# EAGLE design Protoboard MX4-7-6 (EAGLE 7.7.0)
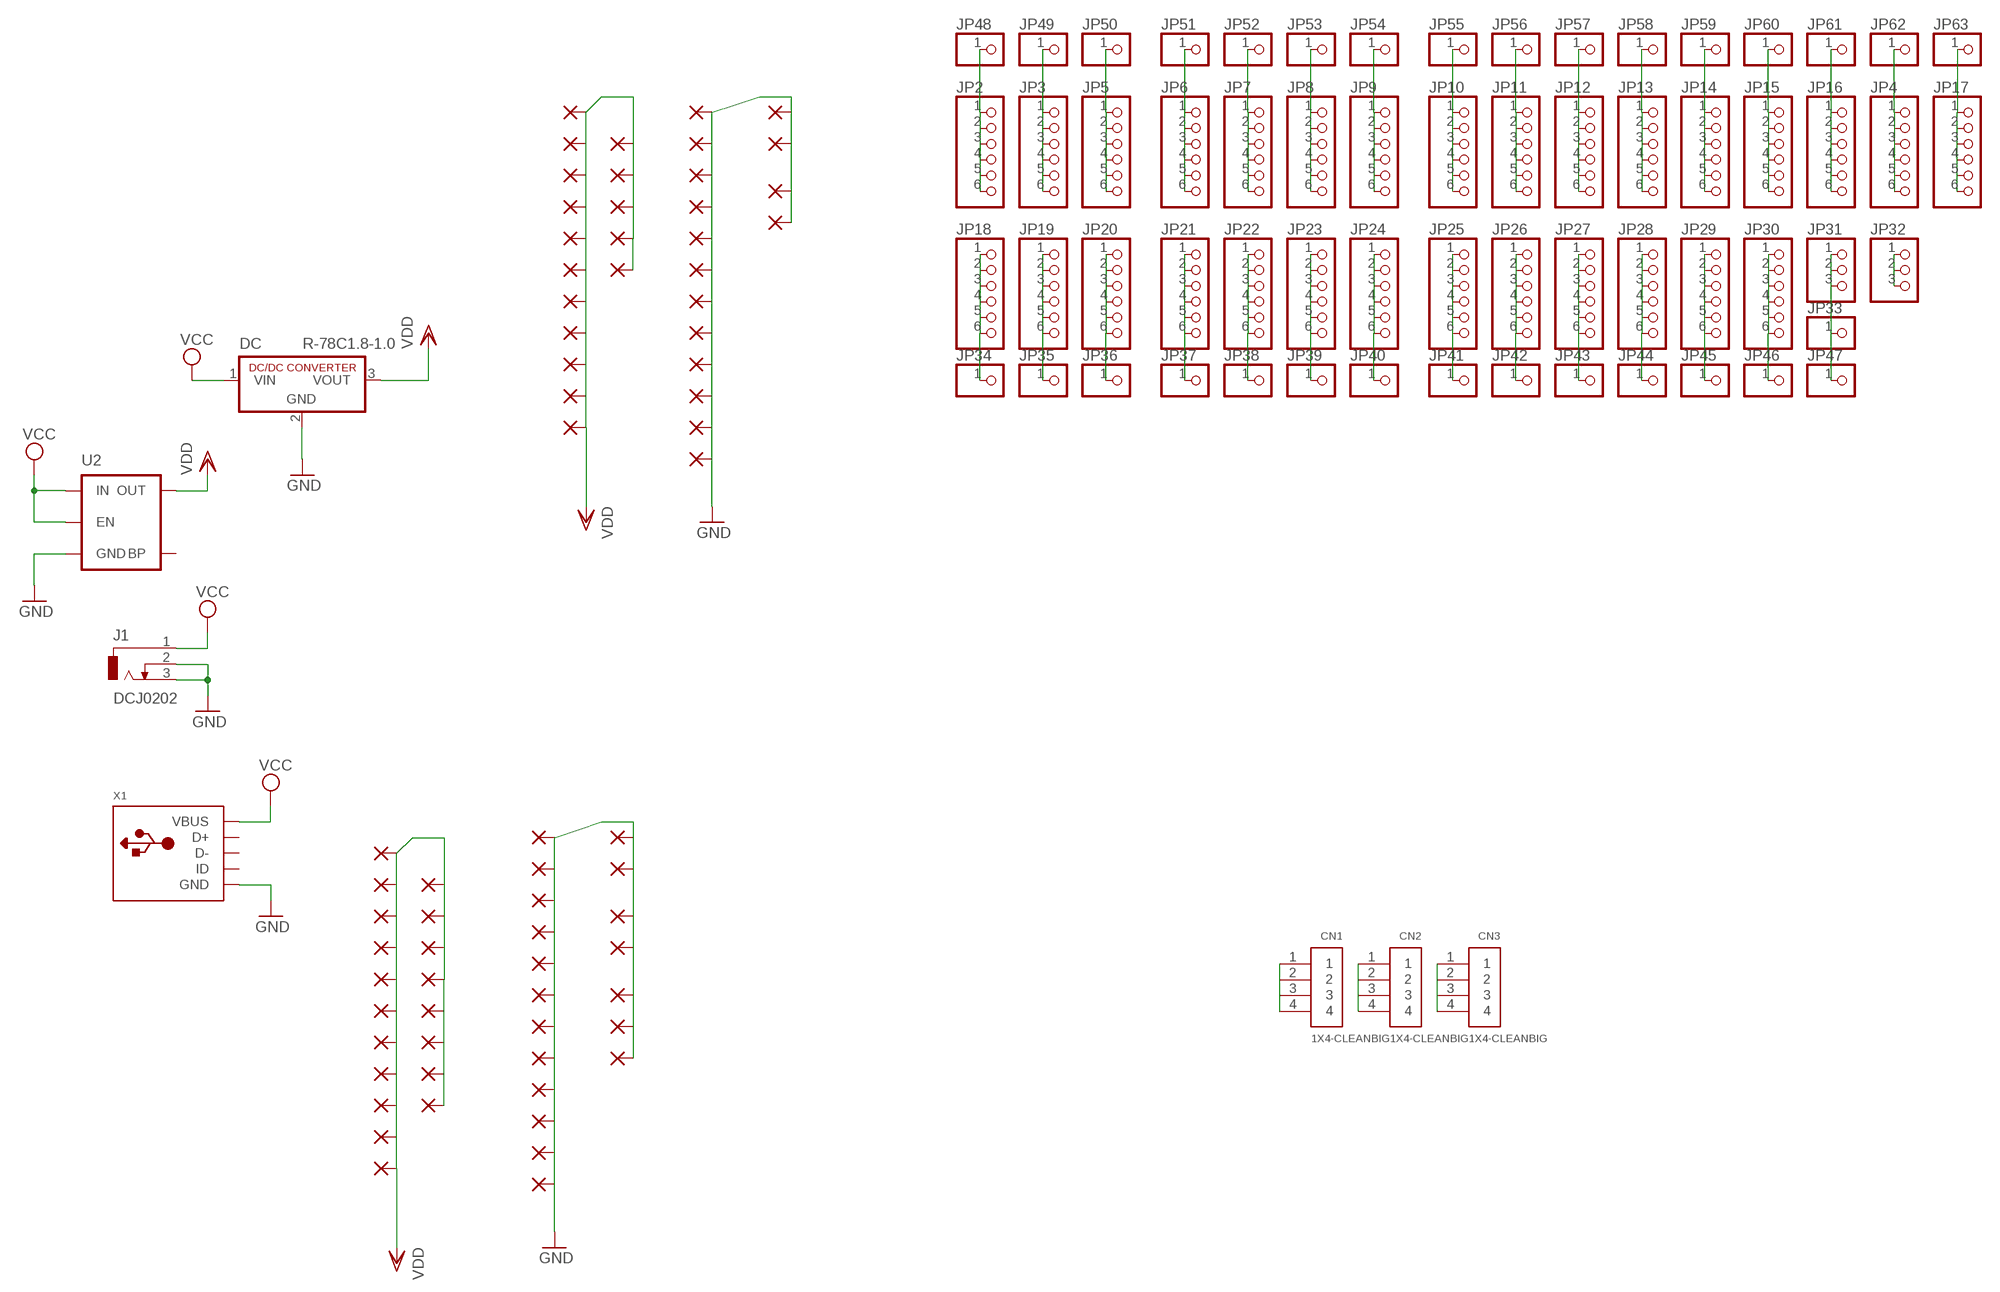
[diagram p0: schematic, sheet 1]

## Parts
CN1  1X4-CLEANBIG  [1X04-CLEANBIG]
CN2  1X4-CLEANBIG  [1X04-CLEANBIG]
CN3  1X4-CLEANBIG  [1X04-CLEANBIG]
DC  R-78C1.8-1.0  [SIP3]
J1  DCJ0202  [DCJ0202]
JP2  PINHD-1X6CB  [1X06-CLEANBIG]
JP3  PINHD-1X6CB  [1X06-CLEANBIG]
JP4  PINHD-1X6CB  [1X06-CLEANBIG]
JP5  PINHD-1X6CB  [1X06-CLEANBIG]
JP6  PINHD-1X6CB  [1X06-CLEANBIG]
JP7  PINHD-1X6CB  [1X06-CLEANBIG]
JP8  PINHD-1X6CB  [1X06-CLEANBIG]
JP9  PINHD-1X6CB  [1X06-CLEANBIG]
JP10  PINHD-1X6CB  [1X06-CLEANBIG]
JP11  PINHD-1X6CB  [1X06-CLEANBIG]
JP12  PINHD-1X6CB  [1X06-CLEANBIG]
JP13  PINHD-1X6CB  [1X06-CLEANBIG]
JP14  PINHD-1X6CB  [1X06-CLEANBIG]
JP15  PINHD-1X6CB  [1X06-CLEANBIG]
JP16  PINHD-1X6CB  [1X06-CLEANBIG]
JP17  PINHD-1X6CB  [1X06-CLEANBIG]
JP18  PINHD-1X6CB  [1X06-CLEANBIG]
JP19  PINHD-1X6CB  [1X06-CLEANBIG]
JP20  PINHD-1X6CB  [1X06-CLEANBIG]
JP21  PINHD-1X6CB  [1X06-CLEANBIG]
JP22  PINHD-1X6CB  [1X06-CLEANBIG]
JP23  PINHD-1X6CB  [1X06-CLEANBIG]
JP24  PINHD-1X6CB  [1X06-CLEANBIG]
JP25  PINHD-1X6CB  [1X06-CLEANBIG]
JP26  PINHD-1X6CB  [1X06-CLEANBIG]
JP27  PINHD-1X6CB  [1X06-CLEANBIG]
JP28  PINHD-1X6CB  [1X06-CLEANBIG]
JP29  PINHD-1X6CB  [1X06-CLEANBIG]
JP30  PINHD-1X6CB  [1X06-CLEANBIG]
JP31  PINHD-1X3CB  [1X03-CLEANBIG]
JP32  PINHD-1X3CB  [1X03-CLEANBIG]
JP33  PINHD-1X1CB  [1X01-CLEANBIG]
JP34  PINHD-1X1CB  [1X01-CLEANBIG]
JP35  PINHD-1X1CB  [1X01-CLEANBIG]
JP36  PINHD-1X1CB  [1X01-CLEANBIG]
JP37  PINHD-1X1CB  [1X01-CLEANBIG]
JP38  PINHD-1X1CB  [1X01-CLEANBIG]
JP39  PINHD-1X1CB  [1X01-CLEANBIG]
JP40  PINHD-1X1CB  [1X01-CLEANBIG]
JP41  PINHD-1X1CB  [1X01-CLEANBIG]
JP42  PINHD-1X1CB  [1X01-CLEANBIG]
JP43  PINHD-1X1CB  [1X01-CLEANBIG]
JP44  PINHD-1X1CB  [1X01-CLEANBIG]
JP45  PINHD-1X1CB  [1X01-CLEANBIG]
JP46  PINHD-1X1CB  [1X01-CLEANBIG]
JP47  PINHD-1X1CB  [1X01-CLEANBIG]
JP48  PINHD-1X1CB  [1X01-CLEANBIG]
JP49  PINHD-1X1CB  [1X01-CLEANBIG]
JP50  PINHD-1X1CB  [1X01-CLEANBIG]
JP51  PINHD-1X1CB  [1X01-CLEANBIG]
JP52  PINHD-1X1CB  [1X01-CLEANBIG]
JP53  PINHD-1X1CB  [1X01-CLEANBIG]
JP54  PINHD-1X1CB  [1X01-CLEANBIG]
JP55  PINHD-1X1CB  [1X01-CLEANBIG]
JP56  PINHD-1X1CB  [1X01-CLEANBIG]
JP57  PINHD-1X1CB  [1X01-CLEANBIG]
JP58  PINHD-1X1CB  [1X01-CLEANBIG]
JP59  PINHD-1X1CB  [1X01-CLEANBIG]
JP60  PINHD-1X1CB  [1X01-CLEANBIG]
JP61  PINHD-1X1CB  [1X01-CLEANBIG]
JP62  PINHD-1X1CB  [1X01-CLEANBIG]
JP63  PINHD-1X1CB  [1X01-CLEANBIG]
PAD4  1,6/0,8  [1,6/0,8]
PAD5  1,6/0,8  [1,6/0,8]
PAD6  1,6/0,8  [1,6/0,8]
PAD7  1,6/0,8  [1,6/0,8]
PAD8  1,6/0,8  [1,6/0,8]
PAD9  1,6/0,8  [1,6/0,8]
PAD10  1,6/0,8  [1,6/0,8]
PAD11  1,6/0,8  [1,6/0,8]
PAD12  1,6/0,8  [1,6/0,8]
PAD13  1,6/0,8  [1,6/0,8]
PAD14  1,6/0,8  [1,6/0,8]
PAD15  1,6/0,8  [1,6/0,8]
PAD16  1,6/0,8  [1,6/0,8]
PAD17  1,6/0,8  [1,6/0,8]
PAD18  1,6/0,8  [1,6/0,8]
PAD19  1,6/0,8  [1,6/0,8]
PAD20  1,6/0,8  [1,6/0,8]
PAD21  1,6/0,8  [1,6/0,8]
PAD22  1,6/0,8  [1,6/0,8]
PAD23  1,6/0,8  [1,6/0,8]
PAD24  1,6/0,8  [1,6/0,8]
PAD25  1,6/0,8  [1,6/0,8]
PAD26  1,6/0,8  [1,6/0,8]
PAD27  1,6/0,8  [1,6/0,8]
PAD28  1,6/0,8  [1,6/0,8]
PAD29  1,6/0,8  [1,6/0,8]
PAD30  1,6/0,8  [1,6/0,8]
PAD31  1,6/0,8  [1,6/0,8]
PAD32  1,6/0,8  [1,6/0,8]
PAD33  1,6/0,8  [1,6/0,8]
PAD36  1,6/0,8  [1,6/0,8]
PAD38  1,6/0,8  [1,6/0,8]
PAD421  1,6/0,8  [1,6/0,8]
PAD422  1,6/0,8  [1,6/0,8]
PAD423  1,6/0,8  [1,6/0,8]
PAD424  1,6/0,8  [1,6/0,8]
PAD425  1,6/0,8  [1,6/0,8]
PAD426  1,6/0,8  [1,6/0,8]
PAD427  1,6/0,8  [1,6/0,8]
PAD428  1,6/0,8  [1,6/0,8]
PAD429  1,6/0,8  [1,6/0,8]
PAD430  1,6/0,8  [1,6/0,8]
PAD431  1,6/0,8  [1,6/0,8]
PAD432  1,6/0,8  [1,6/0,8]
PAD433  1,6/0,8  [1,6/0,8]
PAD434  1,6/0,8  [1,6/0,8]
PAD435  1,6/0,8  [1,6/0,8]
PAD436  1,6/0,8  [1,6/0,8]
PAD439  1,6/0,8  [1,6/0,8]
PAD440  1,6/0,8  [1,6/0,8]
PAD441  1,6/0,8  [1,6/0,8]
PAD442  1,6/0,8  [1,6/0,8]
PAD443  1,6/0,8  [1,6/0,8]
PAD444  1,6/0,8  [1,6/0,8]
PAD445  1,6/0,8  [1,6/0,8]
PAD446  1,6/0,8  [1,6/0,8]
PAD447  1,6/0,8  [1,6/0,8]
PAD448  1,6/0,8  [1,6/0,8]
PAD449  1,6/0,8  [1,6/0,8]
PAD450  1,6/0,8  [1,6/0,8]
PAD451  1,6/0,8  [1,6/0,8]
PAD452  1,6/0,8  [1,6/0,8]
PAD453  1,6/0,8  [1,6/0,8]
PAD454  1,6/0,8  [1,6/0,8]
PAD455  1,6/0,8  [1,6/0,8]
PAD456  1,6/0,8  [1,6/0,8]
PAD459  1,6/0,8  [1,6/0,8]
PAD460  1,6/0,8  [1,6/0,8]
PAD461  1,6/0,8  [1,6/0,8]
PAD462  1,6/0,8  [1,6/0,8]
U2  MIC52053.3V  [SOT23-5]
X1  USBMICRO_20329  [4UCONN_20329]

## Nets
GND: DC.2(GND) J1.2 J1.3 PAD4.1(P) PAD17.1(P) PAD22.1(P) PAD23.1(P) PAD24.1(P) PAD25.1(P) PAD26.1(P) PAD27.1(P) PAD28.1(P) PAD29.1(P) PAD30.1(P) PAD31.1(P) PAD32.1(P) PAD33.1(P) PAD36.1(P) PAD38.1(P) PAD421.1(P) PAD422.1(P) PAD423.1(P) PAD424.1(P) PAD425.1(P) PAD426.1(P) PAD427.1(P) PAD428.1(P) PAD429.1(P) PAD430.1(P) PAD431.1(P) PAD432.1(P) PAD433.1(P) PAD434.1(P) PAD435.1(P) PAD436.1(P) PAD439.1(P) PAD440.1(P) PAD441.1(P) U2.2(GND) X1.BASE@1(GND) X1.BASE@2(GND) X1.GND X1.SPRT@1(GND) X1.SPRT@2(GND) X1.SPRT@3(GND) X1.SPRT@4(GND)
N$1: JP2.1 JP2.2 JP2.3 JP2.4 JP2.5 JP2.6 JP48.1
N$2: CN1.1 CN1.2 CN1.3 CN1.4
N$3: CN2.1 CN2.2 CN2.3 CN2.4
N$4: CN3.1 CN3.2 CN3.3 CN3.4
N$5: JP3.1 JP3.2 JP3.3 JP3.4 JP3.5 JP3.6 JP49.1
N$6: JP5.1 JP5.2 JP5.3 JP5.4 JP5.5 JP5.6 JP50.1
N$7: JP6.1 JP6.2 JP6.3 JP6.4 JP6.5 JP6.6 JP51.1
N$8: JP7.1 JP7.2 JP7.3 JP7.4 JP7.5 JP7.6 JP52.1
N$9: JP8.1 JP8.2 JP8.3 JP8.4 JP8.5 JP8.6 JP53.1
N$10: JP9.1 JP9.2 JP9.3 JP9.4 JP9.5 JP9.6 JP54.1
N$11: JP10.1 JP10.2 JP10.3 JP10.4 JP10.5 JP10.6 JP55.1
N$12: JP11.1 JP11.2 JP11.3 JP11.4 JP11.5 JP11.6 JP56.1
N$13: JP12.1 JP12.2 JP12.3 JP12.4 JP12.5 JP12.6 JP57.1
N$14: JP13.1 JP13.2 JP13.3 JP13.4 JP13.5 JP13.6 JP58.1
N$15: JP14.1 JP14.2 JP14.3 JP14.4 JP14.5 JP14.6 JP59.1
N$16: JP15.1 JP15.2 JP15.3 JP15.4 JP15.5 JP15.6 JP60.1
N$17: JP16.1 JP16.2 JP16.3 JP16.4 JP16.5 JP16.6 JP61.1
N$18: JP4.1 JP4.2 JP4.3 JP4.4 JP4.5 JP4.6 JP62.1
N$19: JP17.1 JP17.2 JP17.3 JP17.4 JP17.5 JP17.6 JP63.1
N$20: JP18.1 JP18.2 JP18.3 JP18.4 JP18.5 JP18.6 JP34.1
N$21: JP19.1 JP19.2 JP19.3 JP19.4 JP19.5 JP19.6 JP35.1
N$22: JP20.1 JP20.2 JP20.3 JP20.4 JP20.5 JP20.6 JP36.1
N$27: JP21.1 JP21.2 JP21.3 JP21.4 JP21.5 JP21.6 JP37.1
N$28: JP22.1 JP22.2 JP22.3 JP22.4 JP22.5 JP22.6 JP38.1
N$29: JP23.1 JP23.2 JP23.3 JP23.4 JP23.5 JP23.6 JP39.1
N$30: JP24.1 JP24.2 JP24.3 JP24.4 JP24.5 JP24.6 JP40.1
N$31: JP25.1 JP25.2 JP25.3 JP25.4 JP25.5 JP25.6 JP41.1
N$32: JP26.1 JP26.2 JP26.3 JP26.4 JP26.5 JP26.6 JP42.1
N$33: JP27.1 JP27.2 JP27.3 JP27.4 JP27.5 JP27.6 JP43.1
N$35: JP28.1 JP28.2 JP28.3 JP28.4 JP28.5 JP28.6 JP44.1
N$36: JP29.1 JP29.2 JP29.3 JP29.4 JP29.5 JP29.6 JP45.1
N$37: JP30.1 JP30.2 JP30.3 JP30.4 JP30.5 JP30.6 JP46.1
N$38: JP31.1 JP31.2 JP31.3 JP33.1 JP47.1
N$39: JP32.1 JP32.2 JP32.3
VCC: DC.1(VIN) J1.1 U2.1(IN) U2.3(EN) X1.VBUS
VDD: DC.3(VOUT) PAD5.1(P) PAD6.1(P) PAD7.1(P) PAD8.1(P) PAD9.1(P) PAD10.1(P) PAD11.1(P) PAD12.1(P) PAD13.1(P) PAD14.1(P) PAD15.1(P) PAD16.1(P) PAD18.1(P) PAD19.1(P) PAD20.1(P) PAD21.1(P) PAD442.1(P) PAD443.1(P) PAD444.1(P) PAD445.1(P) PAD446.1(P) PAD447.1(P) PAD448.1(P) PAD449.1(P) PAD450.1(P) PAD451.1(P) PAD452.1(P) PAD453.1(P) PAD454.1(P) PAD455.1(P) PAD456.1(P) PAD459.1(P) PAD460.1(P) PAD461.1(P) PAD462.1(P) U2.5(OUT)
Unconnected: U2.4(BP) X1.D+ X1.D- X1.ID

## Library data of the parts
CN1-CN3 = adafruit:1X4: 4-pin connector
DC = dc-dc-converter:R-78C*-1.0: INNOLINE DC/DC-Converter 1.0 AMP SIP3 Single Output Source: Data sheet <http://www.mikrocontroller.net/attachment/150645/157764-da-01-en-DC_DC_WANDLER_R_78C5_0_1_0.pdf>
J1 = con-jack:DCJ0202: DC POWER JACK Source: DCJ0202.pdf; OC_FARNELL: unknown; OC_NEWARK: unknown
JP2-JP30 = adafruit:PINHD-1X6: PIN HEADER
JP31 JP32 = adafruit:PINHD-1X3: PIN HEADER
JP33-JP63 = adafruit:PINHD-1X1: Pin header 1x1 for 0.1" spacing With round pins
PAD4-PAD33 PAD36 PAD38 PAD421-PAD436 PAD439-PAD456 PAD459-PAD462 = wirepad:1,6/0,8: THROUGH-HOLE PAD
U2 = SparkFun-PowerIC:MIC5205: MIC5205 150mA vreg 3.3V - VREG-00822 5V - VREG-00823; PROD_ID: VREG-00822
X1 = microbuilder:USB: USB Connectors USBMINIB - Surface Mount Female Mini-B USB Connector 4UConnector: 06564

## Net classes
0 default: width 0.508 mm, drill 0.508 mm, clearance 0.127 mm

## Board
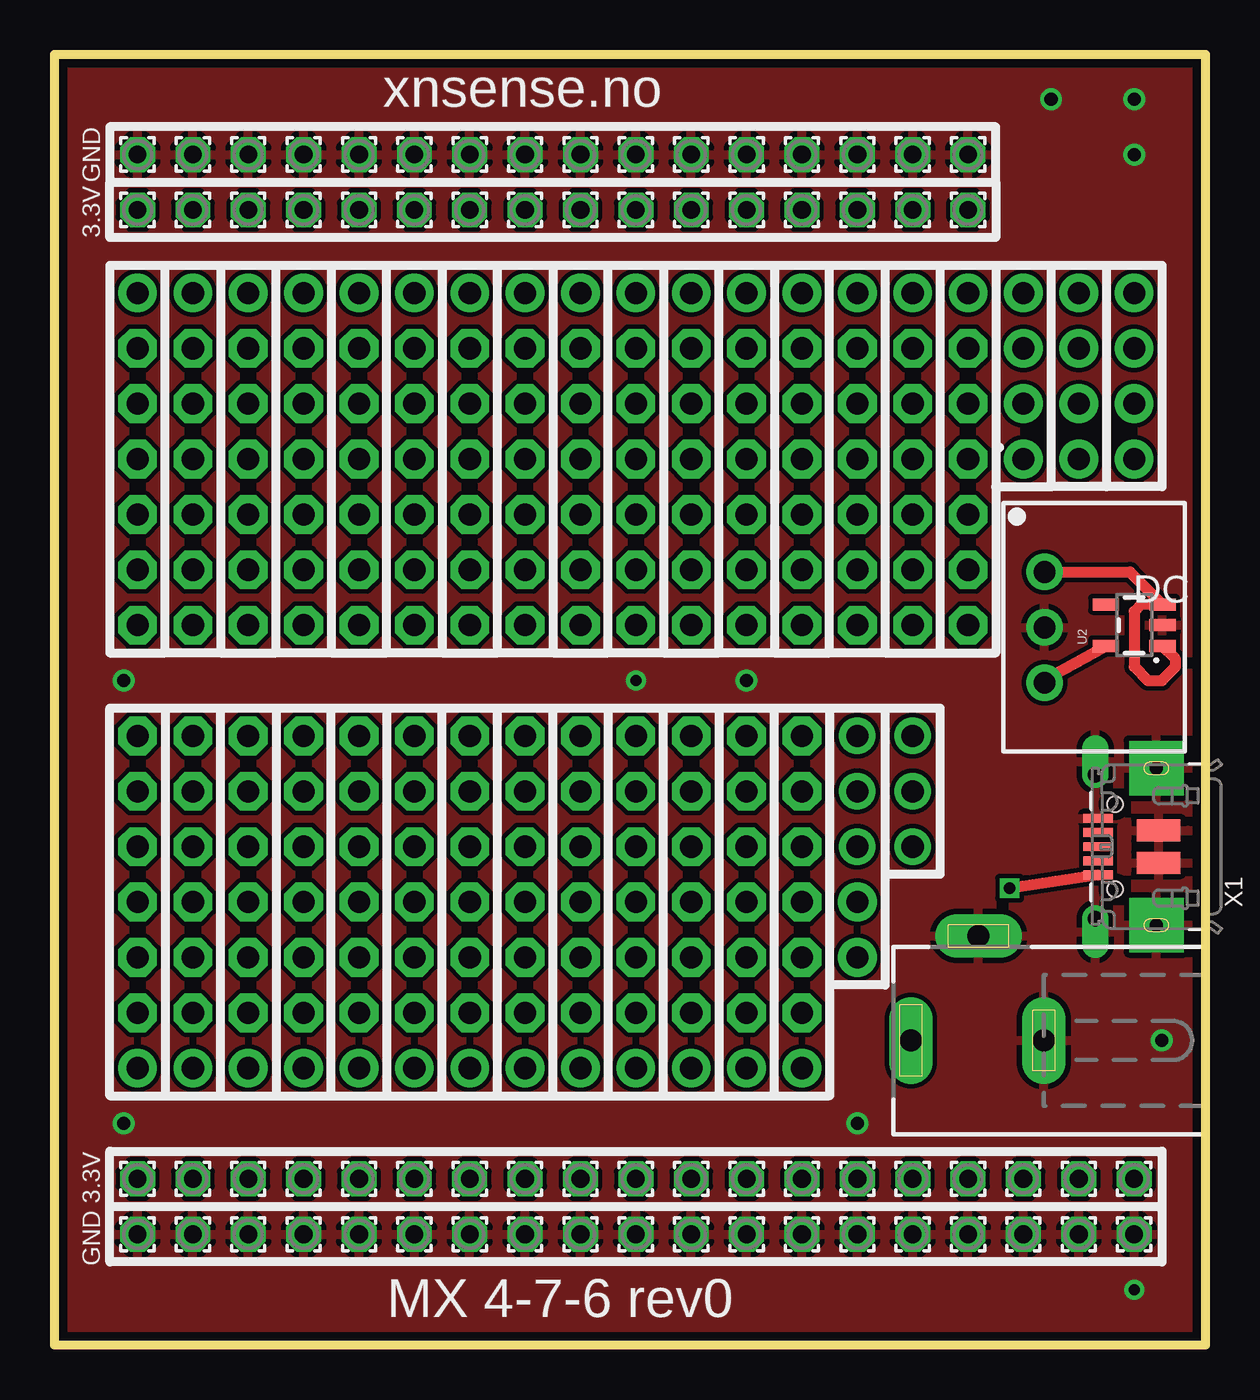
[diagram p1: board, top side]
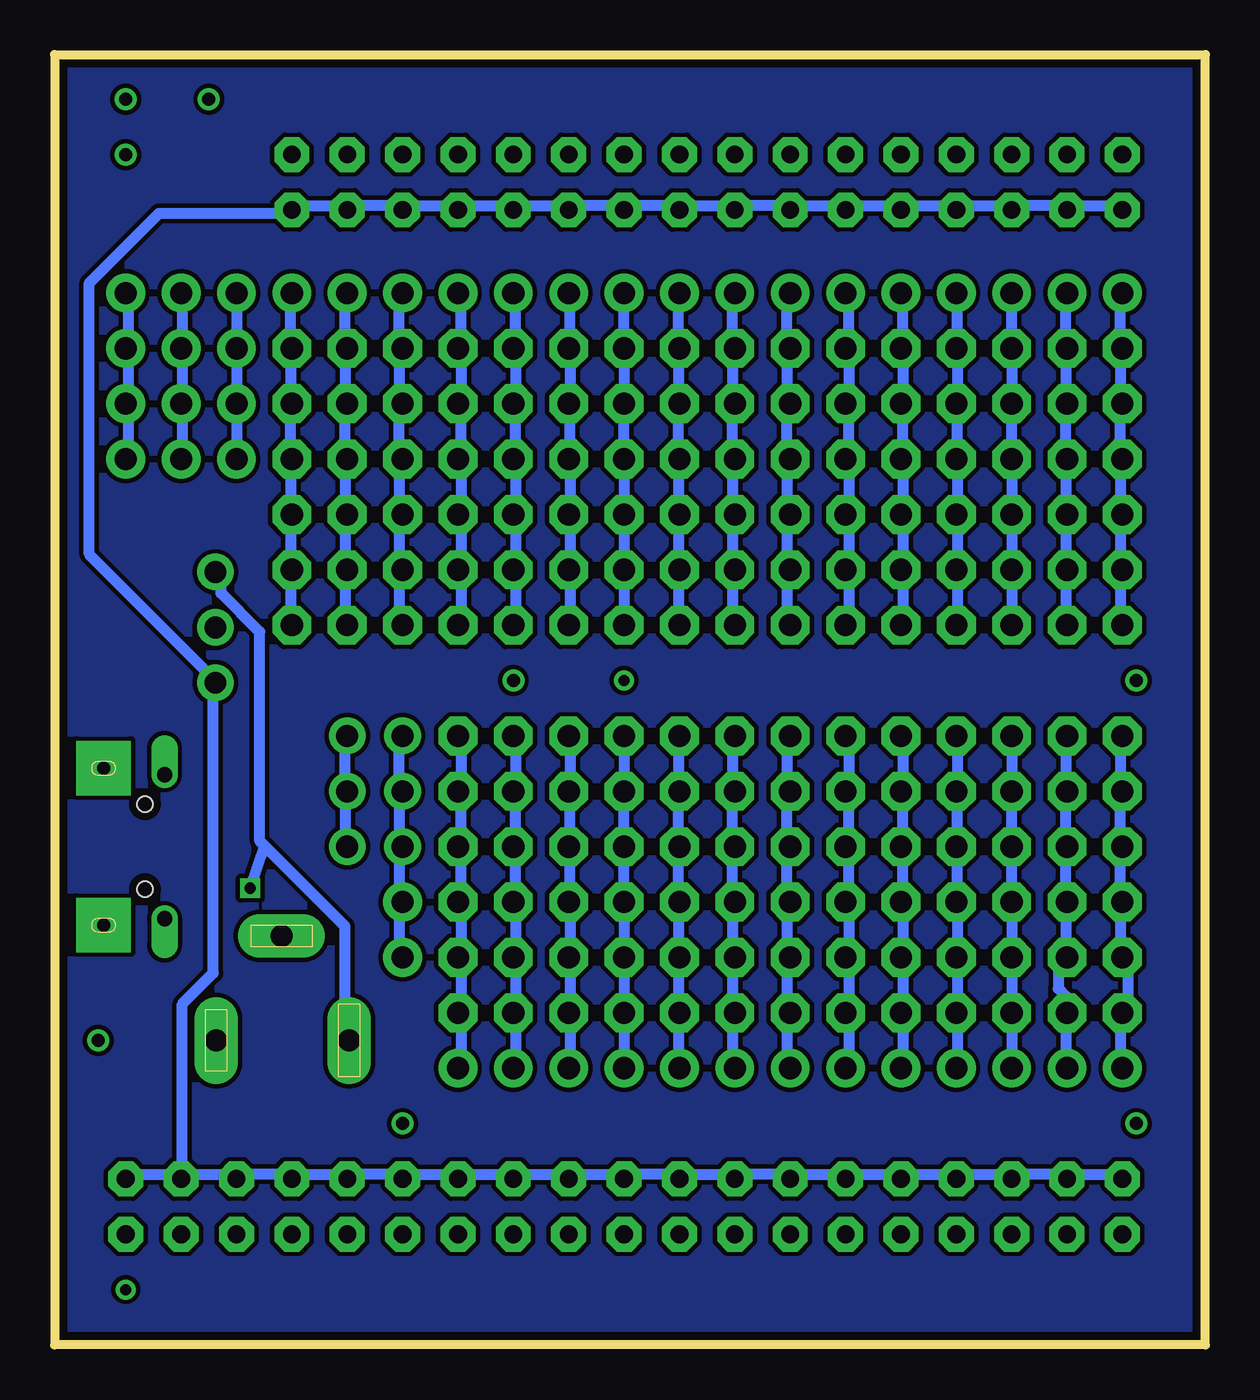
[diagram p2: board, bottom side, seen from below]

Size 52.8 x 59.2 mm. Coordinates in mm from the lower left corner, seen from the top.
Outline: 0,0 0,59.2 52.8,59.2 52.8,0 0,0
Copper layers (1*16): Top 0.035mm / dielectric 1.5mm / Bottom 0.035mm
Design rules "default *": minimum track width 10mil, minimum drill 20mil, track to track 8mil, track to pad 8mil, pad to pad 8mil, via to via 8mil, smd to smd 8mil, copper to edge 15mil, drill to drill 8mil, minimum pad ring 10mil, minimum via ring 8mil, stop-mask expansion 4mil, vias tented up to drill 0mil, thermal gap 10mil

### Footprints (pad centres in the part's own frame; a part is rotated, then mirrored left to right if it is on the bottom)
1X04-CLEANBIG = drill 1.016 pad 1.778: 1 -3.81,0; 2 -1.27,0; 3 1.27,0; 4 3.81,0
SIP3 = drill 1 pad 1.676: 1 -2.54,0; 2 0,0; 3 2.54,0
DCJ0202 = drill 1 pad 2 long: 1 0,3.1; 2 4.8,0; 3 0,-3
1X06-CLEANBIG = drill 1.016 pad 1.778 octagon: 1 -6.35,0; 2 -3.81,0; 3 -1.27,0; 4 1.27,0; 5 3.81,0; 6 6.35,0
1X03-CLEANBIG = drill 1.016 pad 1.676: 1 -2.54,0; 2 0,0; 3 2.54,0
1X01-CLEANBIG = drill 1.016 pad 1.778: 1 0,0
1,6/0,8 = drill 0.813 pad 1.6 octagon: 1 0,0
SOT23-5 = smd 0.55 x 1.2: 1 -0.95,-1.3; 2 0,-1.3; 3 0.95,-1.3; 4 0.95,1.3; 5 -0.95,1.3
4UCONN_20329 = smd 1 x 2: BASE@1 -0.75,-2; BASE@2 0.75,-2 | smd 0.4 x 1.35: D+ 0,0.775; D- -0.65,0.775; GND 1.3,0.775; ID 0.65,0.775; VBUS -1.3,0.775 | drill 0.7 offset: SPRT@1 -3.3,0.9; SPRT@2 3.3,0.9 | drill 0.6 pad 2.5 square: SPRT@3 -3.6,-1.9; SPRT@4 3.6,-1.9 | hole 0.7: -1.95,0; 1.95,0

### Placement (x,y rotation side)
CN1  44.45,44.45 90 top
CN2  46.99,44.45 90 top
CN3  49.53,44.45 90 top
DC  45.42,32.92 270 top
J1  42.39,13.97 90 top
JP2  3.81,39.37 90 top
JP3  6.35,39.37 90 top
JP4  8.89,39.37 90 top
JP5  11.43,39.37 90 top
JP6  13.97,39.37 90 top
JP7  16.51,39.37 90 top
JP8  19.05,39.37 90 top
JP9  21.59,39.37 90 top
JP10  24.13,39.37 90 top
JP11  26.67,39.37 90 top
JP12  29.21,39.37 90 top
JP13  31.75,39.37 90 top
JP14  34.29,39.37 90 top
JP15  36.83,39.37 90 top
JP16  39.37,39.37 90 top
JP17  41.91,39.37 90 top
JP18  3.81,21.59 90 top
JP19  6.35,21.59 90 top
JP20  8.89,21.59 90 top
JP21  11.43,21.59 90 top
JP22  13.97,21.59 90 top
JP23  16.51,21.59 90 top
JP24  19.05,21.59 90 top
JP25  21.59,21.59 90 top
JP26  24.13,21.59 90 top
JP27  26.67,21.59 90 top
JP28  29.21,21.59 90 top
JP29  31.75,21.59 90 top
JP30  34.29,21.59 90 top
JP31  36.83,25.4 90 top
JP32  39.37,25.4 90 top
JP33  36.83,20.32 0 top
JP34  3.81,12.7 0 top
JP35  6.35,12.7 0 top
JP36  8.89,12.7 0 top
JP37  11.43,12.7 0 top
JP38  13.97,12.7 0 top
JP39  16.51,12.7 0 top
JP40  19.05,12.7 0 top
JP41  21.59,12.7 0 top
JP42  24.13,12.7 0 top
JP43  26.67,12.7 0 top
JP44  29.21,12.7 0 top
JP45  31.75,12.7 0 top
JP46  34.29,12.7 0 top
JP47  36.83,17.78 0 top
JP48  3.81,48.26 0 top
JP49  6.35,48.26 0 top
JP50  11.43,48.26 0 top
JP51  13.97,48.26 0 top
JP52  16.51,48.26 0 top
JP53  19.05,48.26 0 top
JP54  21.59,48.26 0 top
JP55  24.13,48.26 0 top
JP56  26.67,48.26 0 top
JP57  29.21,48.26 0 top
JP58  31.75,48.26 0 top
JP59  34.29,48.26 0 top
JP60  36.83,48.26 0 top
JP61  39.37,48.26 0 top
JP62  8.89,48.26 0 top
JP63  41.91,48.26 0 top
PAD4  19.05,54.61 0 top
PAD5  39.37,52.07 0 top
PAD6  16.51,52.07 0 top
PAD7  19.05,52.07 0 top
PAD8  21.59,52.07 0 top
PAD9  36.83,52.07 0 top
PAD10  3.81,52.07 0 top
PAD11  13.97,52.07 0 top
PAD12  34.29,52.07 0 top
PAD13  8.89,52.07 0 top
PAD14  6.35,52.07 0 top
PAD15  31.75,52.07 0 top
PAD16  41.91,52.07 0 top
PAD17  3.81,54.61 0 top
PAD18  29.21,52.07 0 top
PAD19  24.13,52.07 0 top
PAD20  11.43,52.07 0 top
PAD21  26.67,52.07 0 top
PAD22  29.21,54.61 0 top
PAD23  39.37,54.61 0 top
PAD24  6.35,54.61 0 top
PAD25  26.67,54.61 0 top
PAD26  41.91,54.61 0 top
PAD27  8.89,54.61 0 top
PAD28  24.13,54.61 0 top
PAD29  36.83,54.61 0 top
PAD30  11.43,54.61 0 top
PAD31  21.59,54.61 0 top
PAD32  34.29,54.61 0 top
PAD33  13.97,54.61 0 top
PAD36  16.51,54.61 0 top
PAD38  31.75,54.61 0 top
PAD421  3.81,5.08 0 top
PAD422  24.13,5.08 0 top
PAD423  11.43,5.08 0 top
PAD424  6.35,5.08 0 top
PAD425  41.91,5.08 0 top
PAD426  13.97,5.08 0 top
PAD427  8.89,5.08 0 top
PAD428  49.53,5.08 0 top
PAD429  16.51,5.08 0 top
PAD430  36.83,5.08 0 top
PAD431  46.99,5.08 0 top
PAD432  19.05,5.08 0 top
PAD433  39.37,5.08 0 top
PAD434  44.45,5.08 0 top
PAD435  21.59,5.08 0 top
PAD436  34.29,5.08 0 top
PAD439  31.75,5.08 0 top
PAD440  29.21,5.08 0 top
PAD441  26.67,5.08 0 top
PAD442  26.67,7.62 0 top
PAD443  39.37,7.62 0 top
PAD444  3.81,7.62 0 top
PAD445  41.91,7.62 0 top
PAD446  36.83,7.62 0 top
PAD447  6.35,7.62 0 top
PAD448  49.53,7.62 0 top
PAD449  34.29,7.62 0 top
PAD450  8.89,7.62 0 top
PAD451  46.99,7.62 0 top
PAD452  31.75,7.62 0 top
PAD453  11.43,7.62 0 top
PAD454  44.45,7.62 0 top
PAD455  29.21,7.62 0 top
PAD456  13.97,7.62 0 top
PAD459  16.51,7.62 0 top
PAD460  24.13,7.62 0 top
PAD461  21.59,7.62 0 top
PAD462  19.05,7.62 0 top
U2  49.53,33.02 90 top
X1  48.65,22.86 90 top

### Tracks (layer width: path | path; a pad name or v marks a point on that pad's centre or on a via)
GND  (via drill 0.51, 0.6)
  other vias: 36.83,10.16 50.8,13.97 49.53,2.54 31.75,30.48 26.67,30.48 3.17,30.48 3.17,10.16 49.53,54.61 45.72,57.15 49.53,57.15
  pour Top: 0,59.2 0,0 52.8,0 52.8,59.2
N$1
  Bottom 0.508: JP48.1 3.91,48.01 3.91,45.87 JP2.6 3.91,45.52 3.91,43.38 JP2.5 3.91,43.03 3.91,40.89 JP2.4 3.91,40.54 3.91,38.41 JP2.3 3.91,38.05 3.91,35.56 | 3.91,35.56 3.91,33.07 JP2.1 | 3.91,35.56 JP2.2
N$2
  Bottom 0.508: CN1.1 CN1.2 CN1.3 CN1.4
N$3
  Bottom 0.508: CN2.1 46.94,40.89 46.94,43.03 CN2.2 46.94,43.38 46.94,45.52 CN2.3 46.94,45.87 46.94,48.01 CN2.4
N$4
  Bottom 0.508: CN3.1 49.43,40.89 49.43,43.03 CN3.2 49.43,43.38 49.43,45.52 CN3.3 49.43,45.87 49.43,48.01 CN3.4
N$5
  Bottom 0.508: JP49.1 6.4,48.01 6.4,45.87 JP3.6 6.4,45.52 6.4,43.38 JP3.5 6.4,43.03 6.4,40.89 JP3.4 6.4,40.54 6.4,38.41 JP3.3 6.4,38.05 6.4,35.56 | 6.4,35.56 6.4,33.07 JP3.1 | 6.4,35.56 JP3.2
N$6
  Bottom 0.508: JP50.1 11.38,48.01 11.38,45.87 JP5.6 11.38,45.52 11.38,43.38 JP5.5 11.38,43.03 11.38,40.89 JP5.4 11.38,40.54 11.38,38.41 JP5.3 11.38,38.05 11.38,35.56 | 11.38,35.56 11.38,33.07 JP5.1 | 11.38,35.56 JP5.2
N$7
  Bottom 0.508: JP51.1 13.87,48.01 13.87,45.87 JP6.6 13.87,45.52 13.87,43.38 JP6.5 13.87,43.03 13.87,40.89 JP6.4 13.87,40.54 13.87,38.41 JP6.3 13.87,38.05 13.87,35.56 | 13.87,35.56 13.87,33.07 JP6.1 | 13.87,35.56 JP6.2
N$8
  Bottom 0.508: JP52.1 16.36,48.01 16.36,45.87 JP7.6 16.36,45.52 16.36,43.38 JP7.5 16.36,43.03 16.36,40.89 JP7.4 16.36,40.54 16.36,38.41 JP7.3 16.36,38.05 16.36,35.56 | 16.36,35.56 16.36,33.07 JP7.1 | 16.36,35.56 JP7.2
N$9
  Bottom 0.508: JP53.1 19.2,48.01 19.2,45.87 JP8.6 19.2,45.52 19.2,43.38 JP8.5 19.2,43.03 19.2,40.89 JP8.4 19.2,40.54 19.2,38.41 JP8.3 19.2,38.05 19.2,35.56 | 19.2,35.56 19.2,33.07 JP8.1 | 19.2,35.56 JP8.2
N$10
  Bottom 0.508: JP54.1 21.69,48.01 21.69,45.87 JP9.6 21.69,45.52 21.69,43.38 JP9.5 21.69,43.03 21.69,40.89 JP9.4 21.69,40.54 21.69,38.41 JP9.3 21.69,38.05 21.69,35.56 | 21.69,35.56 21.69,33.07 JP9.1 | 21.69,35.56 JP9.2
N$11
  Bottom 0.508: JP55.1 24.18,48.01 24.18,45.87 JP10.6 24.18,45.52 24.18,43.38 JP10.5 24.18,43.03 24.18,40.89 JP10.4 24.18,40.54 24.18,38.41 JP10.3 24.18,38.05 24.18,35.56 | 24.18,35.56 24.18,33.07 JP10.1 | 24.18,35.56 JP10.2
N$12
  Bottom 0.508: JP56.1 JP11.6 JP11.5 JP11.4 JP11.3 JP11.2 JP11.1
N$13
  Bottom 0.508: JP57.1 29.16,48.01 29.16,45.87 JP12.6 29.16,45.52 29.16,43.38 JP12.5 29.16,43.03 29.16,40.89 JP12.4 29.16,40.54 29.16,38.41 JP12.3 29.16,38.05 29.16,35.56 | 29.16,35.56 29.16,33.07 JP12.1 | 29.16,35.56 JP12.2
N$14
  Bottom 0.508: JP58.1 31.65,48.01 31.65,45.87 JP13.6 31.65,45.52 31.65,43.38 JP13.5 31.65,43.03 31.65,40.89 JP13.4 31.65,40.54 31.65,38.41 JP13.3 31.65,38.05 31.65,35.56 | 31.65,35.56 31.65,33.07 JP13.1 | 31.65,35.56 JP13.2
N$15
  Bottom 0.508: JP59.1 34.14,48.01 34.14,45.87 JP14.6 34.14,45.52 34.14,43.38 JP14.5 34.14,43.03 34.14,40.89 JP14.4 34.14,40.54 34.14,38.41 JP14.3 34.14,38.05 34.14,35.56 | 34.14,35.56 34.14,33.07 JP14.1 | 34.14,35.56 JP14.2
N$16
  Bottom 0.508: JP60.1 36.98,48.01 36.98,45.87 JP15.6 36.98,45.52 36.98,43.38 JP15.5 36.98,43.03 36.98,40.89 JP15.4 36.98,40.54 36.98,38.41 JP15.3 36.98,38.05 36.98,35.56 | 36.98,35.56 36.98,33.07 JP15.1 | 36.98,35.56 JP15.2
N$17
  Bottom 0.508: JP61.1 39.47,48.01 39.47,45.87 JP16.6 39.47,45.52 39.47,43.38 JP16.5 39.47,43.03 39.47,40.89 JP16.4 39.47,40.54 39.47,38.41 JP16.3 39.47,38.05 39.47,35.56 | 39.47,35.56 39.47,33.07 JP16.1 | 39.47,35.56 JP16.2
N$18
  Bottom 0.508: JP62.1 JP4.6 JP4.5 JP4.4 JP4.3 JP4.2 JP4.1
N$19
  Bottom 0.508: JP63.1 41.96,48.01 41.96,45.87 JP17.6 41.96,45.52 41.96,43.38 JP17.5 41.96,43.03 41.96,40.89 JP17.4 41.96,40.54 41.96,38.41 JP17.3 41.96,38.05 41.96,35.56 | 41.96,35.56 41.96,33.07 JP17.1 | 41.96,35.56 JP17.2
N$20
  Bottom 0.508: JP18.6 3.91,27.74 3.91,25.6 JP18.5 3.91,25.25 3.91,23.11 JP18.4 3.91,22.76 3.91,20.62 JP18.3 3.91,20.27 3.91,17.78 JP18.2 3.56,17.78 3.56,15.29 JP18.1 3.91,14.94 3.91,12.8 JP34.1
N$21
  Bottom 0.508: JP19.6 6.4,27.74 6.4,25.6 JP19.5 6.4,25.25 6.4,23.11 JP19.4 6.4,22.76 6.4,20.62 JP19.3 6.4,20.27 6.4,17.78 | JP35.1 6.4,12.8 6.4,14.94 JP19.1 6.4,15.29 6.4,16 6.76,16.36 6.76,17.42 6.4,17.78 | 6.4,17.78 JP19.2
N$22
  Bottom 0.508: JP20.6 JP20.5 JP20.4 JP20.3 JP20.2 JP20.1 JP36.1
N$27
  Bottom 0.508: JP21.6 11.38,27.74 11.38,25.6 JP21.5 11.38,25.25 11.38,23.11 JP21.4 11.38,22.76 11.38,20.62 JP21.3 11.38,20.27 11.38,17.78 | JP37.1 11.38,12.8 11.38,14.94 JP21.1 11.38,15.29 11.38,17.78 | 11.38,17.78 JP21.2
N$28
  Bottom 0.508: JP22.6 13.87,27.74 13.87,25.6 JP22.5 13.87,25.25 13.87,23.11 JP22.4 13.87,22.76 13.87,20.62 JP22.3 13.87,20.27 13.87,17.78 | JP38.1 13.87,12.8 13.87,14.94 JP22.1 13.87,15.29 13.87,17.78 | 13.87,17.78 JP22.2
N$29
  Bottom 0.508: JP23.6 16.36,27.74 16.36,25.6 JP23.5 16.36,25.25 16.36,23.11 JP23.4 16.36,22.76 16.36,20.62 JP23.3 16.36,20.27 16.36,17.78 | JP39.1 16.36,12.8 16.36,14.94 JP23.1 16.36,15.29 16.36,17.78 | 16.36,17.78 JP23.2
N$30
  Bottom 0.508: JP24.6 19.2,27.74 19.2,25.6 JP24.5 19.2,25.25 19.2,23.11 JP24.4 19.2,22.76 19.2,20.62 JP24.3 19.2,20.27 19.2,17.78 | JP40.1 19.2,12.8 19.2,14.94 JP24.1 19.2,15.29 19.2,17.78 | 19.2,17.78 JP24.2
N$31
  Bottom 0.508: JP25.6 21.69,27.74 21.69,25.6 JP25.5 21.69,25.25 21.69,23.11 JP25.4 21.69,22.76 21.69,20.62 JP25.3 21.69,20.27 21.69,17.78 | JP41.1 21.69,12.8 21.69,14.94 JP25.1 21.69,15.29 21.69,17.78 | 21.69,17.78 JP25.2
N$32
  Bottom 0.508: JP26.6 24.18,27.74 24.18,25.6 JP26.5 24.18,25.25 24.18,23.11 JP26.4 24.18,22.76 24.18,20.62 JP26.3 24.18,20.27 24.18,17.78 | JP42.1 24.18,12.8 24.18,14.94 JP26.1 24.18,15.29 24.18,17.78 | 24.18,17.78 JP26.2
N$33
  Bottom 0.508: JP27.6 JP27.5 JP27.4 JP27.3 JP27.2 JP27.1 JP43.1
N$35
  Bottom 0.508: JP28.6 29.16,27.74 29.16,25.6 JP28.5 29.16,25.25 29.16,23.11 JP28.4 29.16,22.76 29.16,20.62 JP28.3 29.16,20.27 29.16,17.78 | JP44.1 29.16,12.8 29.16,14.94 JP28.1 29.16,15.29 29.16,17.78 | 29.16,17.78 JP28.2
N$36
  Bottom 0.508: JP29.6 31.65,27.74 31.65,25.6 JP29.5 31.65,25.25 31.65,23.11 JP29.4 31.65,22.76 31.65,20.62 JP29.3 31.65,20.27 31.65,17.78 | JP45.1 31.65,12.8 31.65,14.94 JP29.1 31.65,15.29 31.65,17.78 | 31.65,17.78 JP29.2
N$37
  Bottom 0.508: JP30.6 34.14,27.74 34.14,25.6 JP30.5 34.14,25.25 34.14,23.11 JP30.4 34.14,22.76 34.14,20.62 JP30.3 34.14,20.27 34.14,17.78 | JP46.1 34.14,12.8 34.14,14.94 JP30.1 34.14,15.29 34.14,17.78 | 34.14,17.78 JP30.2
N$38
  Bottom 0.508: JP47.1 36.98,17.78 36.98,20.27 JP33.1 36.98,20.62 36.98,22.76 JP31.1 36.98,23.11 36.98,25.25 JP31.2 36.98,25.6 36.98,27.74 JP31.3
N$39
  Bottom 0.508: JP32.1 39.47,23.11 39.47,25.25 JP32.2 39.47,25.6 39.47,27.74 JP32.3
N$45
  pour Bottom: 0,59.2 52.8,59.2 52.8,0 0,0
VCC  (via drill 0.51)
  Top 0.508: X1.VBUS v43.81,20.95 | DC.1 49.34,35.46 U2.3 49.84,33.97 49.53,33.66 49.53,31.11 50.16,30.48 50.8,30.48 51.44,31.11 51.44,31.46 U2.1
  Bottom 0.508: 43.16,22.89 39.47,19.2 39.47,14.22 J1.1 | 43.16,22.89 43.38,23.11 43.38,32.72 45.16,34.49 45.16,35.2 DC.1 | v43.81,20.95 43.16,22.89
VDD  (via drill 0.51)
  Top 0.508: v45.52,30.58 U2.5
  Bottom 0.508: 26.67,52.27 24.18,52.27 PAD19.1 23.82,52.27 21.69,52.27 PAD8.1 21.34,52.27 19.2,52.27 PAD7.1 18.85,52.27 16.71,52.27 PAD6.1 16.36,52.27 14.22,52.27 PAD11.1 13.87,52.27 11.73,52.27 PAD20.1 11.38,52.27 8.89,52.27 | PAD10.1 3.91,52.27 6.04,52.27 PAD14.1 6.4,52.27 8.89,52.27 | 8.89,52.27 PAD13.1 | 26.67,52.27 29.16,52.27 PAD18.1 29.52,52.27 31.65,52.27 PAD15.1 32,52.27 34.14,52.27 PAD12.1 34.49,52.27 36.63,52.27 PAD9.1 36.98,52.27 39.12,52.27 PAD5.1 39.47,52.27 41.6,52.27 PAD16.1 41.96,51.92 48.01,51.92 51.21,48.72 51.21,36.27 v45.52,30.58 DC.3 45.52,30.23 45.52,17.07 46.94,15.65 46.94,7.82 | 26.67,52.27 PAD21.1 | 26.67,7.82 24.18,7.82 PAD460.1 23.82,7.82 21.69,7.82 PAD461.1 21.34,7.82 19.2,7.82 PAD462.1 18.85,7.82 16.71,7.82 PAD459.1 16.36,7.82 14.22,7.82 PAD456.1 13.87,7.82 11.73,7.82 PAD453.1 11.38,7.82 8.89,7.82 | PAD444.1 3.91,7.82 6.04,7.82 PAD447.1 6.4,7.82 8.89,7.82 | 8.89,7.82 PAD450.1 | 44.45,7.82 41.96,7.82 PAD445.1 41.6,7.82 39.47,7.82 PAD443.1 39.12,7.82 36.98,7.82 PAD446.1 36.63,7.82 34.49,7.82 PAD449.1 34.14,7.82 32,7.82 PAD452.1 31.65,7.82 29.52,7.82 PAD455.1 29.16,7.82 26.67,7.82 | PAD448.1 49.43,7.82 47.3,7.82 PAD451.1 46.94,7.82 | 46.94,7.82 44.45,7.82 | 44.45,7.82 PAD454.1 | 26.67,7.82 PAD442.1

### Text on the board
tNames: xnsense.no | GND | 3.3V | 3.3V | GND | MX 4-7-6 rev0